# EAGLE design kachisys (EAGLE 9.1.3)
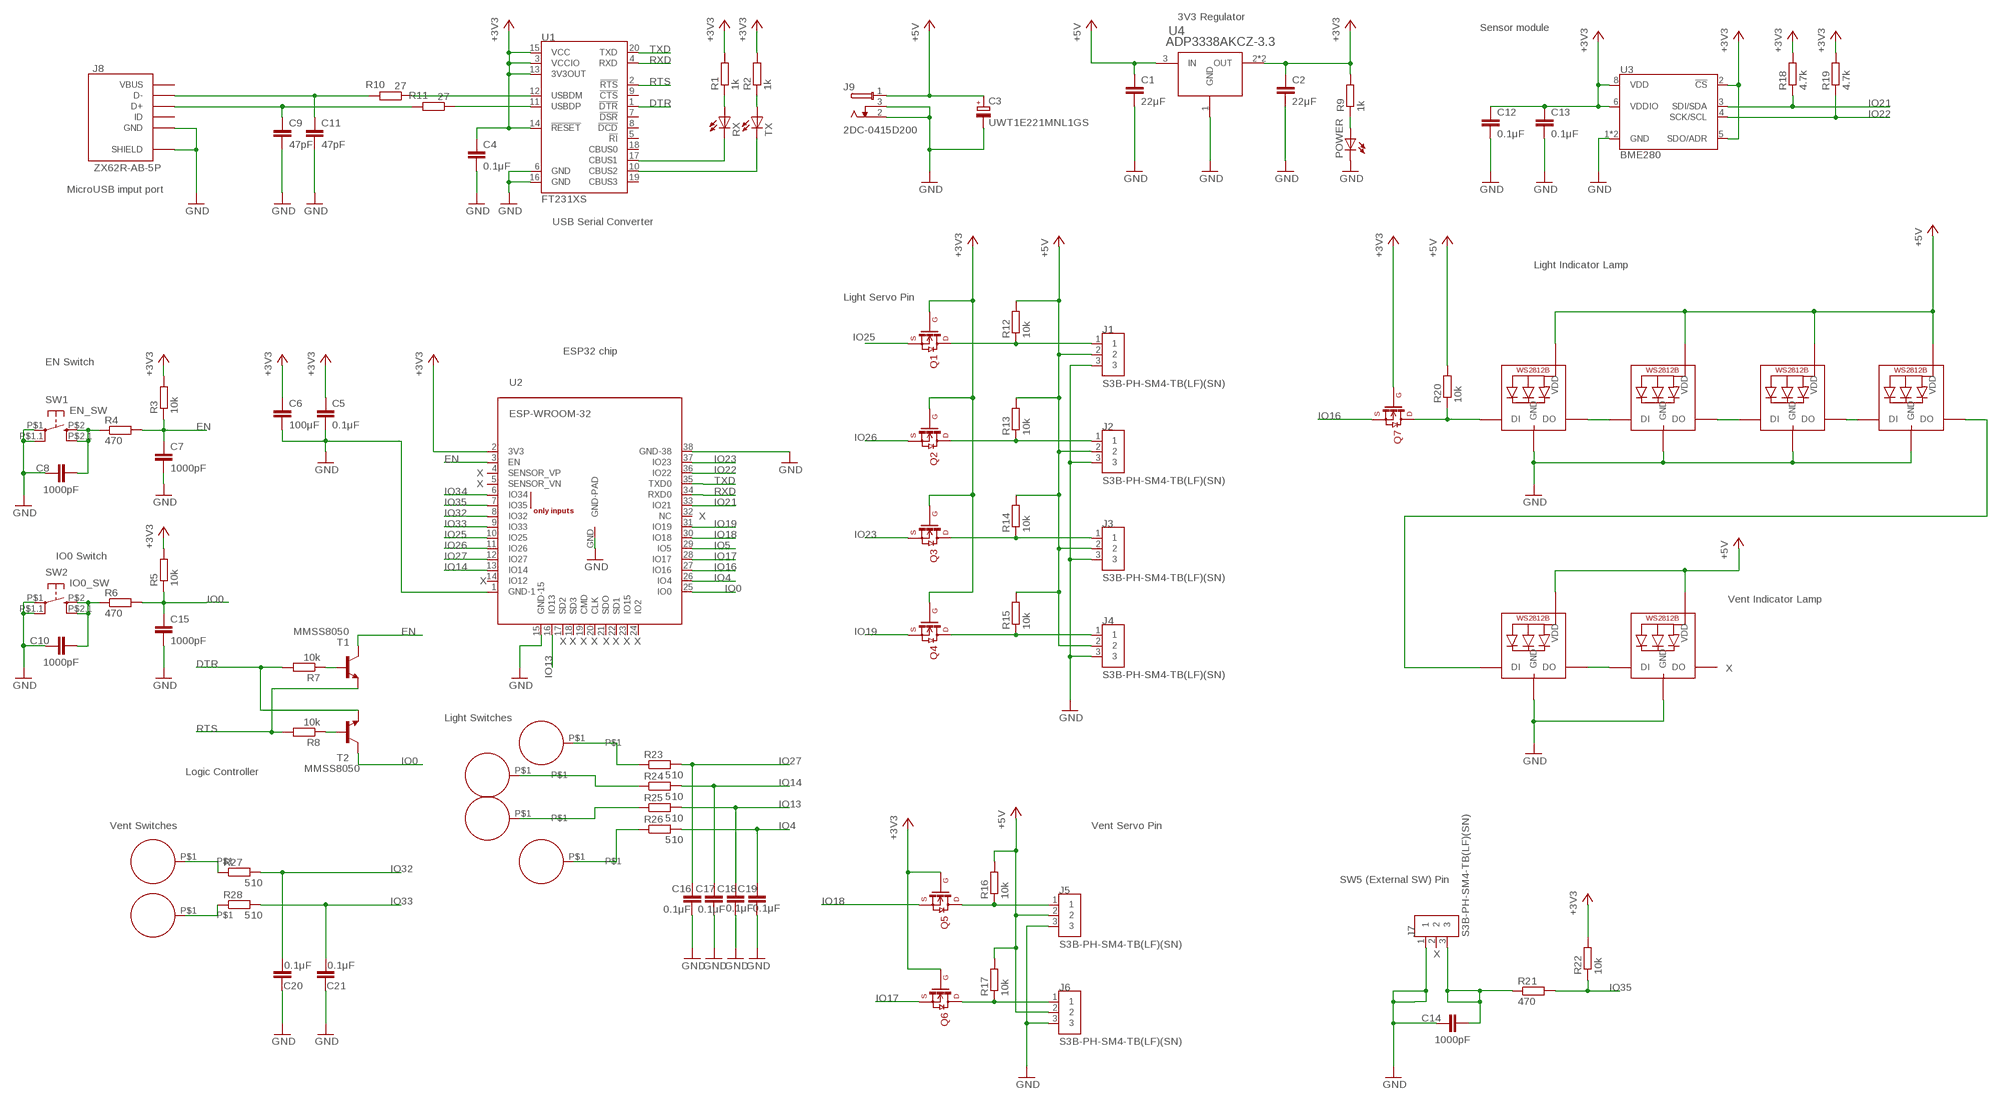
[diagram p0: schematic, sheet 1]

## Parts
C1  22μF  C-EUC2012  [C2012]
C2  22μF  C-EUC2012  [C2012]
C3  UWT1E221MNL1GS  [NICHICON-ALMINUM-CAPACITOR-8MM]
C4  0.1μF  C-EUC0603  [C0603]
C5  0.1μF  C-EUC0603  [C0603]
C6  100μF  C-EUC3225  [C3225]
C7  1000pF  C-EUC0603  [C0603]
C8  1000pF  C-EUC0603  [C0603]
C9  47pF  C-EUC1608  [C1608]
C10  1000pF  C-EUC0603  [C0603]
C11  47pF  C-EUC1608  [C1608]
C12  0.1μF  C-EUC0603  [C0603]
C13  0.1μF  C-EUC0603  [C0603]
C14  1000pF  C-EUC0603  [C0603]
C15  1000pF  C-EUC0603  [C0603]
C16  0.1μF  C-EUC0603  [C0603]
C17  0.1μF  C-EUC0603  [C0603]
C18  0.1μF  C-EUC0603  [C0603]
C19  0.1μF  C-EUC0603  [C0603]
C20  0.1μF  C-EUC0603  [C0603]
C21  0.1μF  C-EUC0603  [C0603]
J1  S3B-PH-SM4-TB(LF)(SN)  [JST_S3B-PH-SM4-TB(LF)(SN)]
J2  S3B-PH-SM4-TB(LF)(SN)  [JST_S3B-PH-SM4-TB(LF)(SN)]
J3  S3B-PH-SM4-TB(LF)(SN)  [JST_S3B-PH-SM4-TB(LF)(SN)]
J4  S3B-PH-SM4-TB(LF)(SN)  [JST_S3B-PH-SM4-TB(LF)(SN)]
J5  S3B-PH-SM4-TB(LF)(SN)  [JST_S3B-PH-SM4-TB(LF)(SN)]
J6  S3B-PH-SM4-TB(LF)(SN)  [JST_S3B-PH-SM4-TB(LF)(SN)]
J7  S3B-PH-SM4-TB(LF)(SN)  [JST_S3B-PH-SM4-TB(LF)(SN)]
J8  ZX62R-AB-5P  [ZX62R-B-5PA]
J9  2DC-0415D200  [2DC-0415D200]
LED1  WS2812B_5050N  [WS2812B-NARROW]
LED2  WS2812B_5050N  [WS2812B-NARROW]
LED3  WS2812B_5050N  [WS2812B-NARROW]
LED4  WS2812B_5050N  [WS2812B-NARROW]
LED5  WS2812B_5050N  [WS2812B-NARROW]
LED6  WS2812B_5050N  [WS2812B-NARROW]
POWER  LEDCHIP-LED0603  [CHIP-LED0603]
Q1  BSS138  [SOT-23]
Q2  BSS138  [SOT-23]
Q3  BSS138  [SOT-23]
Q4  BSS138  [SOT-23]
Q5  BSS138  [SOT-23]
Q6  BSS138  [SOT-23]
Q7  BSS138  [SOT-23]
R1  1k  R-EU_R0603  [R0603]
R2  1k  R-EU_R0603  [R0603]
R3  10k  R-EU_R0603  [R0603]
R4  470  R-EU_R0603  [R0603]
R5  10k  R-EU_R0603  [R0603]
R6  470  R-EU_R0603  [R0603]
R7  10k  R-EU_R0603  [R0603]
R8  10k  R-EU_R0603  [R0603]
R9  1k  R-EU_R0603  [R0603]
R10  27  R-EU_R0603  [R0603]
R11  27  R-EU_R0603  [R0603]
R12  10k  R-EU_R0603  [R0603]
R13  10k  R-EU_R0603  [R0603]
R14  10k  R-EU_R0603  [R0603]
R15  10k  R-EU_R0603  [R0603]
R16  10k  R-EU_R0603  [R0603]
R17  10k  R-EU_R0603  [R0603]
R18  4.7k  R-EU_R0603  [R0603]
R19  4.7k  R-EU_R0603  [R0603]
R20  10k  R-EU_R0603  [R0603]
R21  470  R-EU_R0603  [R0603]
R22  10k  R-EU_R0603  [R0603]
R23  510  R-EU_R0603  [R0603]
R24  510  R-EU_R0603  [R0603]
R25  510  R-EU_R0603  [R0603]
R26  510  R-EU_R0603  [R0603]
R27  510  R-EU_R0603  [R0603]
R28  510  R-EU_R0603  [R0603]
RX  LEDCHIP-LED0603  [CHIP-LED0603]
SW1  EN_SW  DTS6_SMD  [SKRPACE010]
SW2  IO0_SW  DTS6_SMD  [SKRPACE010]
T1  MMSS8050  -NPN-SOT23-EBC  [SOT23-EBC]
T2  MMSS8050  -NPN-SOT23-EBC  [SOT23-EBC]
TPAD1  ESP32-TOUCHPAD  [ESP32-TOUCHPAD-10MM]
TPAD2  ESP32-TOUCHPAD  [ESP32-TOUCHPAD-10MM]
TPAD3  ESP32-TOUCHPAD  [ESP32-TOUCHPAD-10MM]
TPAD4  ESP32-TOUCHPAD  [ESP32-TOUCHPAD-10MM]
TPAD5  ESP32-TOUCHPAD  [ESP32-TOUCHPAD-10MM]
TPAD6  ESP32-TOUCHPAD  [ESP32-TOUCHPAD-10MM]
TX  LEDCHIP-LED0603  [CHIP-LED0603]
U1  FT231XS  [SSOP20_L]
U2  ESP-WROOM-32  [ESP-WROOM-32]
U3  BME280  [LGA-8-2.5X2.5]
U4  ADP3338AKCZ-3.3  [SOT233]

## Nets
+3V3 [3V3]: C2.1 C4.1 C5.1 C6.1 C12.1 C13.1 Q1.G Q2.G Q3.G Q4.G Q5.G Q6.G Q7.G R1.2 R2.2 R3.2 R5.2 R9.2 R18.2 R19.2 R22.2 U1.3(VCCIO) U1.13(3V3OUT) U1.14(!RESET) U1.15(VCC) U2.2(3V3) U3.2(!CS) U3.5(SDO/ADR) U3.6(VDDIO) U3.8(VDD) U4.2(OUT) U4.4(OUT)
+5V [5V]: C1.1 C3.POS(+) J1.2 J2.2 J3.2 J4.2 J5.2 J6.2 J9.1 LED1.1-VDD(VDD) LED2.1-VDD(VDD) LED3.1-VDD(VDD) LED4.1-VDD(VDD) LED5.1-VDD(VDD) LED6.1-VDD(VDD) R12.2 R13.2 R14.2 R15.2 R16.2 R17.2 R20.2 U4.3(IN)
DTR: R7.2 T2.E U1.1(!DTR)
EN: C7.1 R3.1 R4.2 T1.C U2.3(EN)
GND [GND]: C1.2 C2.2 C3.NEG(-) C4.2 C5.2 C6.2 C7.2 C8.1 C9.2 C10.1 C11.2 C12.2 C13.2 C14.1 C15.2 C16.2 C17.2 C18.2 C19.2 C20.1 C21.1 J1.3 J2.3 J3.3 J4.3 J5.3 J6.3 J7.1 J8.GND J8.SHIELD@1(SHIELD) J8.SHIELD@2(SHIELD) J8.SHIELD@3(SHIELD) J8.SHIELD@4(SHIELD) J9.2 J9.3 LED1.3-GND(GND) LED2.3-GND(GND) LED3.3-GND(GND) LED4.3-GND(GND) LED5.3-GND(GND) LED6.3-GND(GND) POWER.C SW1.P$1(P) SW1.P$1.1(P1) SW2.P$1(P) SW2.P$1.1(P1) U1.6(GND) U1.16(GND) U2.1(GND-1) U2.15(GND-15) U2.38(GND-38) U2.GND(GND-PAD) U3.1(GND) U3.7(GND) U4.1(GND)
IO0: C15.1 R5.1 R6.2 T2.C U2.25(IO0)
IO4: C19.1 R26.2 U2.26(IO4)
IO5: U2.29(IO5)
IO13: C18.1 R25.2 U2.16(IO13)
IO14: C17.1 R24.2 U2.13(IO14)
IO16: Q7.S U2.27(IO16)
IO17: Q6.S U2.28(IO17)
IO18: Q5.S U2.30(IO18)
IO19: Q4.S U2.31(IO19)
IO21: R18.1 U2.33(IO21) U3.3(SDI/SDA)
IO22: R19.1 U2.36(IO22) U3.4(SCK/SCL)
IO23: Q3.S U2.37(IO23)
IO25: Q1.S U2.10(IO25)
IO26: Q2.S U2.11(IO26)
IO27: C16.1 R23.2 U2.12(IO27)
IO32: C20.2 R27.2 U2.8(IO32)
IO33: C21.2 R28.2 U2.9(IO33)
IO34: U2.6(IO34)
IO35: R21.2 R22.1 U2.7(IO35)
N$1: R27.1 TPAD5.P$1
N$2: C11.1 J8.D- R10.2
N$3: C9.1 J8.D+ R11.2
N$4: RX.C U1.17(CBUS1)
N$5: TX.C U1.10(CBUS2)
N$6: C8.2 R4.1 SW1.P$2(S) SW1.P$2.1(S1)
N$7: R1.1 RX.A
N$8: R2.1 TX.A
N$9: R7.1 T1.B
N$10: R8.1 T2.B
N$11: POWER.A R9.1
N$12: C10.2 R6.1 SW2.P$2(S) SW2.P$2.1(S1)
N$13: R28.1 TPAD6.P$1
N$14: R10.1 U1.12(USBDM)
N$15: R11.1 U1.11(USBDP)
N$16: J1.1 Q1.D R12.1
N$17: J2.1 Q2.D R13.1
N$18: J3.1 Q3.D R14.1
N$19: J4.1 Q4.D R15.1
N$21: LED1.2-DOUT(DO) LED2.4-DIN(DI)
N$33: LED2.2-DOUT(DO) LED3.4-DIN(DI)
N$38: LED3.2-DOUT(DO) LED4.4-DIN(DI)
N$39: LED4.2-DOUT(DO) LED5.4-DIN(DI)
N$40: J5.1 Q5.D R16.1
N$41: J6.1 Q6.D R17.1
N$42: LED5.2-DOUT(DO) LED6.4-DIN(DI)
N$43: LED1.4-DIN(DI) Q7.D R20.1
N$46: C14.2 J7.3 R21.1
N$50: R23.1 TPAD1.P$1
N$51: R24.1 TPAD2.P$1
N$52: R25.1 TPAD3.P$1
N$53: R26.1 TPAD4.P$1
RTS: R8.2 T1.E U1.2(!RTS)
RXD: U1.4(RXD) U2.34(RXD0)
TXD: U1.20(TXD) U2.35(TXD0)
Unconnected: J7.2 J8.ID J8.VCC(VBUS) LED6.2-DOUT(DO) U1.5(!RI) U1.7(!DSR) U1.8(!DCD) U1.9(!CTS) U1.18(CBUS0) U1.19(CBUS3) U2.4(SENSOR_VP) U2.5(SENSOR_VN) U2.14(IO12) U2.17(SD2) U2.18(SD3) U2.19(CMD) U2.20(CLK) U2.21(SDO) U2.22(SD1) U2.23(IO15) U2.24(IO2) U2.32(NC)

## Notes on the sheet
- 3V3 Regulator
- Sensor module
- MicroUSB imput port
- USB Serial Converter
- Light Indicator Lamp
- Light Servo Pin
- ESP32 chip
- EN Switch
- X
- X
- X
- IO0 Switch
- X
- Vent Indicator Lamp
- X | X | X | X | X | X | X | X
- X
- Light Switches
- Logic Controller
- Vent Switches | Vent Servo Pin
- SW5 (External SW) Pin
- X

## Library data of the parts
C1 C2 C4-C8 C10 C12-C21 = resistor:C-EU: CAPACITOR, European symbol
C3 = taki-library:UWT1E221MNL1GS
C9 C11 = 150927 Library by matsu:C-EU: CAPACITOR, European symbol
J1-J7 = S3B-PH-SM4-TB_LF__SN_:S3B-PH-SM4-TB(LF)(SN): CONN HEADER PH SIDE 3POS 2MM SMD; DESCRIPTION: PH Series 3 Position 2.0 mm SMT Side Entry Shrouded Header; DIGI-KEY_PART_NUMBER: 455-1750-1-ND; DIGI-KEY_PURCHASE_URL: https://www.digikey.jp/product-detail/en/jst-sales-america-inc/S3B-PH-SM4-TB_LF__SN_/455-1750-1-ND/926847?utm_source=snapeda&utm_medium=aggregator&utm_campaign=symbol; MF: JST Sales; MP: S3B-PH-SM4-TB_LF__SN_; PACKAGE: None
J8 = taki-library:ZX62
J9 = taki-library:2DC-0415D200
LED1-LED6 = adafruit:WS2812B
POWER RX TX = led:LED: LED OSRAM: - CHIPLED LG R971, LG N971, LY N971, LG Q971, LY Q971, LO R971, LY R971 LH N974, LH R974 LS Q976, LO Q976, LY Q976 LO Q996 - Hyper CHIPLED LW Q18S LB Q993, LB Q99A, LB R99A - SideLED LS A670, LO A670, LY A670, LG A670, LP A670 LB A673, LV A673, LT A673, LW A673 LH A674 LY A675 LS A676, LA A676, LO A676, LY A676, LW A676 LS A679, LY A679, LG A679 - Hyper Micro SIDELED® LS Y876, LA Y876, LO Y876, LY Y876 LT Y87S - SmartLED LW L88C, LW L88S LB L89C, LB L89S, LG L890 LS L89K, LO L89K, LY L89K LS L896, LA L896, LO L896, LY L896 - TOPLED LS T670, LO T670, LY T670, LG T670, LP T670 LSG T670, LSP T670, LSY T670, LOP T670, LYG T670 LG T671, LOG T671, LSG T671 LB T673, LV T673, LT T673, LW T673 LH T674 LS T676, LA T676, LO T676, LY T676, LB T676, LH T676, LSB T676, LW T676 LB T67C, LV T67C, LT T67C, LS T67K, LO T67K, LY T67K, LW E67C LS E67B, LA E67B, LO E67B, LY E67B, LB E67C, LV E67C, LT E67C LW T67C LS T679, LY T679, LG T679 LS T770, LO T770, LY T770, LG T770, LP T770 LB T773, LV T773, LT T773, LW T773 LH T774 LS E675, LA E675, LY E675, LS T675 LS T776, LA T776, LO T776, LY T776, LB T776 LHGB T686 LT T68C, LB T68C - Hyper Mini TOPLED® LB M676 - Mini TOPLED Santana® LG M470 LS M47K, LO M47K, LY M47K Source: http://www.osram.convergy.de LUXEON: - LUMILED® LXK2-PW12-R00, LXK2-PW12-S00, LXK2-PW14-U00, LXK2-PW14-V00 LXK2-PM12-R00, LXK2-PM12-S00, LXK2-PM14-U00 LXK2-PE12-Q00, LXK2-PE12-R00, LXK2-PE12-S00, LXK2-PE14-T00, LXK2-PE14-U00 LXK2-PB12-K00, LXK2-PB12-L00, LXK2-PB12-M00, LXK2-PB14-N00, LXK2-PB14-P00, LXK2-PB14-Q00 LXK2-PR12-L00, LXK2-PR12-M00, LXK2-PR14-Q00, LXK2-PR14-R00 LXK2-PD12-Q00, LXK2-PD12-R00, LXK2-PD12-S00 LXK2-PH12-R00, LXK2-PH12-S00 LXK2-PL12-P00, LXK2-PL12-Q00, LXK2-PL12-R00 Source: www.luxeon.com KINGBRIGHT: KA-3528ASYC Source: www.kingbright.com
Q1-Q7 = 180118 Library by matsu:BSS138
R1-R28 = resistor:R-EU_: RESISTOR, European symbol
SW1 SW2 = 180118 Library by matsu:DTS6_SMD
T1 T2 = transistor-neu-to92:*-NPN-: NPN Transistror
TPAD1-TPAD6 = 180118 Library by matsu:ESP32-TOUCHPAD
U1 = SparkFun-IC-Comms:FT231X: FTDI FT231X Full Speed USB to Full-handshake UART This USB2.0 Full Speed IC offers a compact bridge to full handshake UART interfaces. The device is a UART, capable of operating up to 3MBaud, with low power consumption (8mA). The FT231X includes the complete FT-X series feature set and enables USB to be added into a system design quickly and easily over a UART interface. Datasheet <http://cdn.sparkfun.com/datasheets/Components/General%20IC/DS_FT231X.pdf> SparkFun Products SparkFun RedBoard - Programmed with Arduino <https://www.sparkfun.com/products/12757> (DEV-12757) SparkFun XBee Explorer USB <https://www.sparkfun.com/products/11812> (WRL-11812) SparkFun XBee Explorer Dongle <https://www.sparkfun.com/products/11697> (WRL-11697) SparkFun Blynk Board - ESP8266 <https://www.sparkfun.com/products/13794> (WRL-13794) SparkFun ESP8266 Thing - Dev Board <https://www.sparkfun.com/products/13711> (WRL-13711) SparkFun Block for Intel® Edison - Base <https://www.sparkfun.com/products/13045> (DEV-13045) SparkFun RedStick <https://www.sparkfun.com/products/13741> (DEV-13741) SparkFun Beefy 3 - FTDI Basic Breakout <https://www.sparkfun.com/products/13746> (DEV-13746) SparkFun FT231X Breakout <https://www.sparkfun.com/products/11736> (BOB-11736); PROD_ID: IC-11524
U2 = taki-library:ESP-WROOM-32
U3 = taki-library:BME280: Bosch BME280 – Combined Humidity and Pressure Sensor The BME280 is as combined digital humidity, pressure and temperature sensor based on proven sensing principles. The sensor module is housed in an extremely compact metal-lid LGA package with a footprint of only 2.5×2.5mm² with a height of 0.93mm. Its small dimensions and its low power consumption allow the implementation in battery driven devices such as handsets, GPS modules or watches. Datasheet <https://cdn.sparkfun.com/assets/learn_tutorials/4/1/9/BST-BME280_DS001-10.pdf> SparkFun Products SparkFun Atmospheric Sensor Breakout - BME280 <https://www.sparkfun.com/products/13676> (SEN-13676); PROD_ID: IC-13090
U4 = taki-library:ADP3338AKCZ-3.3

## Board
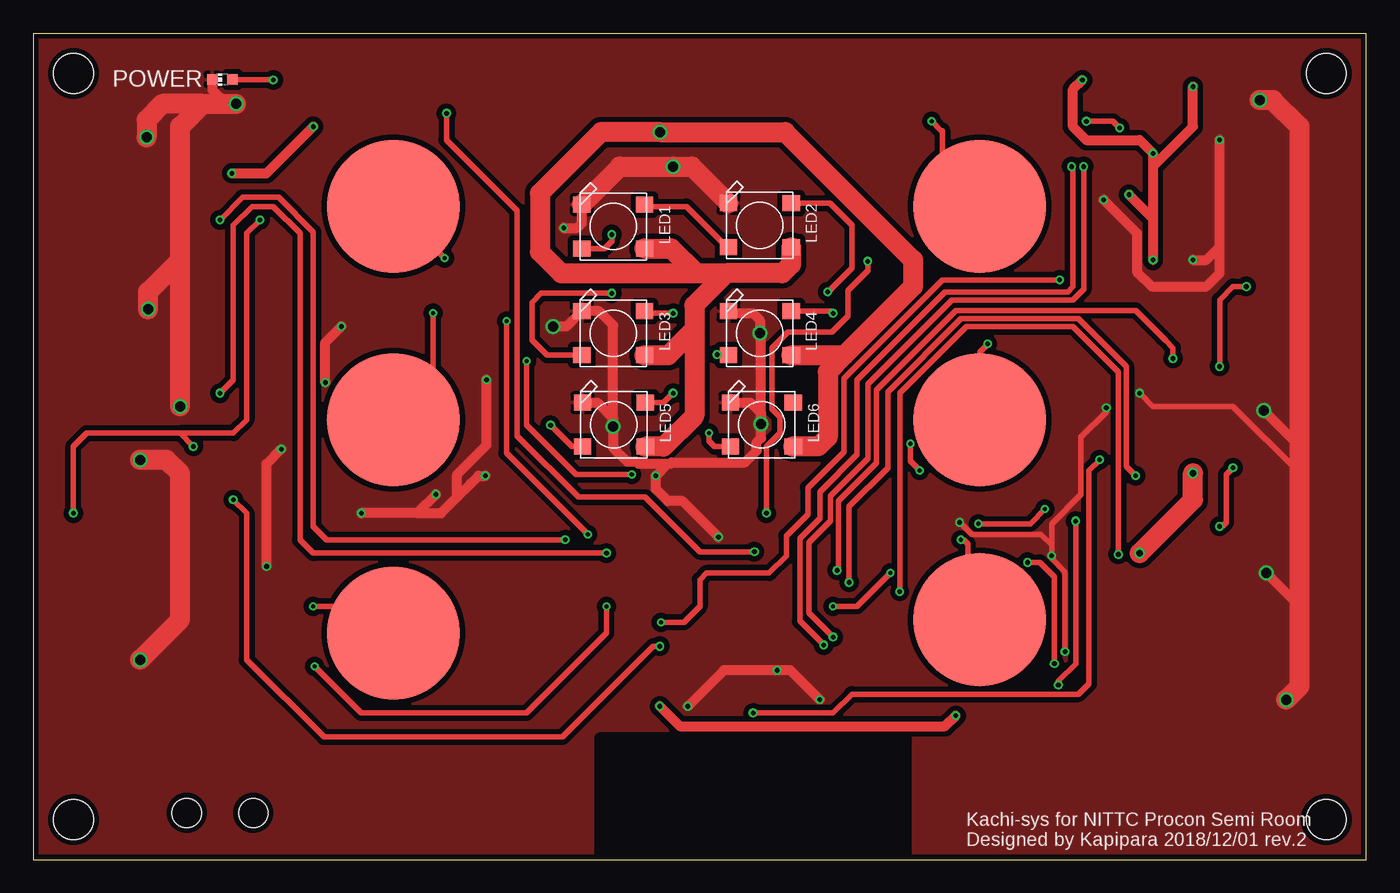
[diagram p1: board, top side]
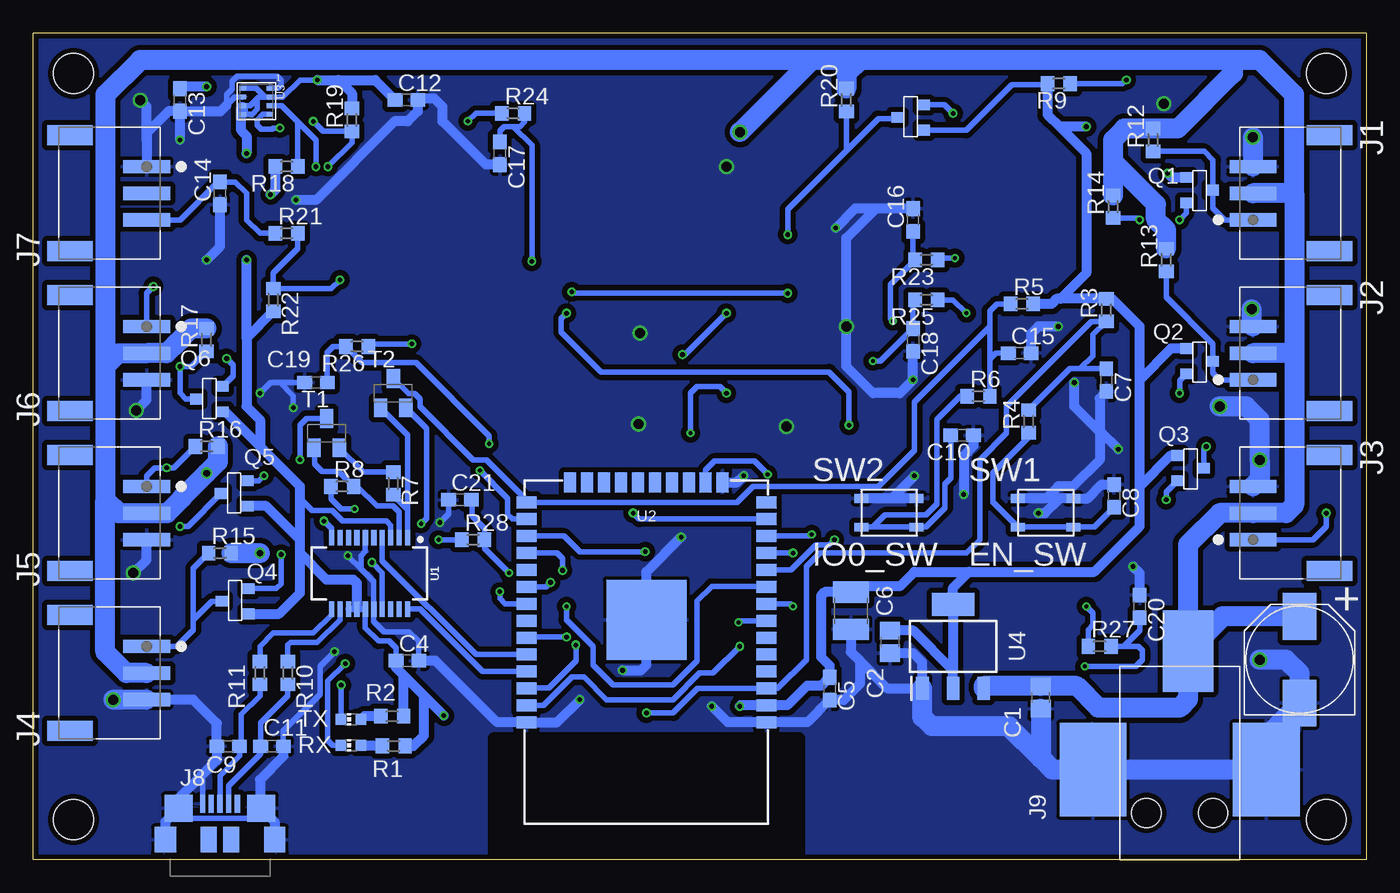
[diagram p2: board, bottom side, seen from below]

Size 100 x 62 mm. Coordinates in mm from the lower left corner, seen from the top.
Outline: 0,0 100,0 100,62 0,62 0,0
Copper layers (1*16): Top 0.035mm / dielectric 1.5mm / Bottom 0.035mm
Design rules "Elecrow_2-layer_eagle_rule": minimum track width 6mil, minimum drill 12mil, track to track 6mil, track to pad 6mil, pad to pad 6mil, via to via 6mil, smd to smd 0mil, copper to edge 10mil, drill to drill 10mil, minimum pad ring 10mil, minimum via ring 6mil, stop-mask expansion 2mil, vias tented up to drill 100mil, thermal gap 10mil
Holes 3 mm at 3,59 97,59 3,3 97,3

### Footprints (pad centres in the part's own frame; a part is rotated, then mirrored left to right if it is on the bottom)
C2012 = smd 1.3 x 1.5: 1 -0.85,0; 2 0.85,0
NICHICON-ALMINUM-CAPACITOR-8MM = smd 2.5 x 3.5: NEG 0,-3.25; POS 0,3.25
C0603 = smd 1.1 x 1: 1 -0.85,0; 2 0.85,0
C3225 = smd 1.6 x 2.7: 1 -1.4,0; 2 1.4,0
C1608 = smd 1.1 x 1: 1 -0.85,0; 2 0.85,0
JST_S3B-PH-SM4-TB(LF)(SN) = smd 1 x 3.5: 1 2,0; 2 0,0; 3 -2,0 | smd 1.5 x 3.4: P1 -4.35,5.75; P2 4.35,5.75
ZX62R-B-5PA = smd 0.4 x 1.35: D+ 0,2.675; D- 0.65,2.675; GND -1.3,2.675; ID -0.65,2.675; VCC 1.3,2.675 | smd 1.2 x 1.9: NC@1 -0.85,0; NC@2 0.85,0 | smd 2.1 x 2: SHIELD@1 -3.1,2.35; SHIELD@2 3.1,2.35 | smd 1.6 x 1.9: SHIELD@3 -4.1,0; SHIELD@4 4.1,0
2DC-0415D200 = smd 6.1 x 3.8: 1 15.65,-0.63 | smd 7 x 5: 2 6.75,6.5; 3 6.75,-6.5 | hole 2.2: 3.5,2.5; 3.5,-2.5
WS2812B-NARROW = smd 1.3 x 1.2: 1-VDD 2.35,-1.65; 2-DOUT 2.35,1.65; 3-GND -2.35,1.65; 4-DIN -2.35,-1.65
CHIP-LED0603 = smd 0.8 x 0.8: A 0,-0.75; C 0,0.75
SOT-23 = smd 0.8 x 0.9: D 0.95,2; G 0,0; S 1.9,0
R0603 = smd 1 x 1.1: 1 -0.85,0; 2 0.85,0
SKRPACE010 = smd 1.05 x 0.65: P$1 0,2.15; P$1.1 4.15,2.15; P$2 0,0; P$2.1 4.15,0
SOT23-EBC = smd 1 x 1.4: B 0.95,-1.1; C 0,1.1; E -0.95,-1.1
ESP32-TOUCHPAD-10MM = smd 10 x 10: P$1 0,0
SSOP20_L = smd 0.381 x 1.143: 1 -2.857,-2.68; 2 -2.223,-2.68; 3 -1.587,-2.68; 4 -0.953,-2.68; 5 -0.318,-2.68; 6 0.318,-2.68; 7 0.953,-2.68; 8 1.587,-2.68; 9 2.223,-2.68; 10 2.857,-2.68; 11 2.857,2.68; 12 2.223,2.68; 13 1.587,2.68; 14 0.953,2.68; 15 0.318,2.68; 16 -0.318,2.68; 17 -0.953,2.68; 18 -1.587,2.68; 19 -2.223,2.68; 20 -2.857,2.68
ESP-WROOM-32 = smd 0.9 x 1.5: 1 7.7,9; 2 6.43,9; 3 5.16,9; 4 3.89,9; 5 2.62,9; 6 1.35,9; 7 0.08,9; 8 -1.19,9; 9 -2.46,9; 10 -3.73,9; 11 -5,9; 12 -6.27,9; 13 -7.54,9; 14 -8.81,9; 25 -8.81,-9; 26 -7.54,-9; 27 -6.27,-9; 28 -5,-9; 29 -3.73,-9; 30 -2.46,-9; 31 -1.19,-9; 32 0.08,-9; 33 1.35,-9; 34 2.62,-9; 35 3.89,-9; 36 5.16,-9; 37 6.43,-9; 38 7.7,-9 | smd 1.5 x 0.9: 15 -10.3,5.715; 16 -10.3,4.445; 17 -10.3,3.175; 18 -10.3,1.905; 19 -10.3,0.635; 20 -10.3,-0.635; 21 -10.3,-1.905; 22 -10.3,-3.175; 23 -10.3,-4.445; 24 -10.3,-5.715 | smd 6 x 6: GND 0,0
LGA-8-2.5X2.5 = smd 0.35 x 0.5: 1 -0.975,1.025; 2 -0.325,1.025; 3 0.325,1.025; 4 0.975,1.025; 5 0.975,-1.025; 6 0.325,-1.025; 7 -0.325,-1.025; 8 -0.975,-1.025
SOT233 = smd 1.75 x 0.95: 1 -3.15,2.3; 2 -3.15,0; 3 -3.15,-2.3 | smd 1.75 x 3.2: 4 3.15,0

### Placement (x,y rotation side)
C1  24.42,12.16 270 bottom
C2  35.73,16.33 270 bottom
C3  5,15 0 bottom
C4  71.93,14.92 0 bottom
C5  40.26,12.82 270 bottom
C6  38.66,18.66 270 bottom
C7  19.5,35.98 270 bottom
C8  18.92,27.28 270 bottom
C9  85.38,8.5 180 bottom
C10  30.31,31.84 180 bottom
C11  82.1,8.5 0 bottom
C12  72,57 0 bottom
C13  89,57 270 bottom
C14  86,50 90 bottom
C15  26,38 0 bottom
C16  34,48 90 bottom
C17  65,53 270 bottom
C18  34,39 270 bottom
C19  78.8,35.8 180 bottom
C20  17,19 270 bottom
C21  68,27 0 bottom
J1  8.5,50 270 bottom
J2  8.5,38 270 bottom
J3  8.5,26 270 bottom
J4  91.5,14 90 bottom
J5  91.5,26 90 bottom
J6  91.5,38 90 bottom
J7  91.5,50 90 bottom
J8  86,1.5 0 bottom
J9  14,0 90 bottom
LED1  43.5,47.5 0 top
LED2  54.5,47.6 0 top
LED3  43.5,39.5 0 top
LED4  54.5,39.5 0 top
LED5  43.55,32.63 0 top
LED6  54.66,32.63 0 top
POWER  14.18,58.53 90 top
Q1  13.5,51.18 270 bottom
Q2  13.5,38.35 270 bottom
Q3  14.16,30.32 270 bottom
Q4  83.86,18.44 90 bottom
Q5  83.93,26.52 90 bottom
Q6  85.78,33.61 90 bottom
Q7  33.17,54.73 90 bottom
R1  72.95,8.53 0 bottom
R2  73.06,10.76 0 bottom
R3  19.5,41.24 90 bottom
R4  25.33,32.89 90 bottom
R5  25.83,41.69 0 bottom
R6  29.09,34.77 0 bottom
R7  73,28.22 270 bottom
R8  76.82,28 0 bottom
R9  23.06,58.22 180 bottom
R10  80.9,14 270 bottom
R11  83,14 270 bottom
R12  16,54 90 bottom
R13  15,45 90 bottom
R14  19,49 90 bottom
R15  86,23 0 bottom
R16  87,31 0 bottom
R17  87,39 90 bottom
R18  81,52 180 bottom
R19  76.1,55.5 90 bottom
R20  39,57 90 bottom
R21  81,47 0 bottom
R22  82,42 270 bottom
R23  33,45 180 bottom
R24  64,56 0 bottom
R25  33,42 180 bottom
R26  75.7,38.5 180 bottom
R27  20,16 0 bottom
R28  67,24 0 bottom
RX  76.17,8.57 90 bottom
SW1  26.13,24.95 0 bottom
SW2  37.88,24.95 0 bottom
T1  78,32 0 bottom
T2  73,35 0 bottom
TPAD1  27,49 0 top
TPAD2  71,49 0 top
TPAD3  27,33 0 top
TPAD4  71,33 0 top
TPAD5  27,17 0 top
TPAD6  71,18 0 top
TX  76.17,10.52 90 bottom
U1  74.77,21.47 180 bottom
U2  54,18 270 bottom
U3  83.27,56.89 270 bottom
U4  31,16 90 bottom

### Tracks (layer width: path | path; a pad name or v marks a point on that pad's centre or on a via)
+3V3  (via drill 0.35)
  Top 0.75: 84,52 v84,53 83,54 79,54 78,55 78,57.8 v78.7,58.5 | 84,52 84,48.1 | 84,48.1 v84,45 | v82.2,49.9 84,48.1 | v69.2,10.8 68.4,10 48.5,10 v47,11.5 | v14.9,51.5 17.5,51.5 v21,55 | 84,52 87,55 v87,58
  Bottom 0.4: C4.1 72.8,14.94 72.8,15.9 73.3,16.4 74.1,16.4 75.09,17.39 U1.15 | Q7.G 30,54.73 26.6,58.13 24,58.13 | U1.3 73.18,25.08 73.5,25.4 76.8,25.4 77.6,26.2 79.1,26.2 80,27.1 | U3.2 82.27,57.2 83.1,57.2 83.15,57.15 | 83.15,57.15 83.65,56.65 83.73,56.57 U3.6 | U3.2 82.62,57.22 83.27,57.87 U3.8 | 83.15,57.15 83.2,57.1 83.2,56.3 83.6,55.9 83.7,55.9 83.72,55.92 U3.5 | U3.2 81.28,57.22 80,58.5 v78.7,58.5
  Bottom 0.5: U1.15 U1.14 U1.13
  Bottom 0.75: 17,28 17,25 20.4,21.6 29.8,21.6 | 17,28 17,36 | 17,36 17,40 19.09,42.09 R3.2 22.91,42.09 | 22.91,42.09 23.21,42.09 23.6,41.7 R5.2 | Q3.G 14.68,30.32 17,28 | Q2.G 14.65,38.35 17,36 | 29.8,21.6 33.9,21.6 35,20.5 38.22,20.5 C6.1 40.64,20.06 40.9,19.8 40.9,15.2 40.26,14.55 C5.1 40.88,13.04 41.96,13.04 43.43,11.57 U2.2 46.93,11.57 v47,11.5 | Q4.G 81.56,18.43 80,20 80,23 | 80,24 80,27.1 80,28 83,31 | 83,31 85.61,33.61 Q6.G | R22.2 84,39.15 | 84,39.15 84,34 83,33 83,31 | U1.14 75.72,20.72 76,21 78,21 80,23 | 80,23 80,24 | 80,24 82.52,26.52 Q5.G | v69.2,10.8 70.7,12.3 | 70.7,12.3 72.21,13.81 | 72.8,14.94 72.8,14.4 72.21,13.81 | R2.2 72.21,13.81 | R1.2 71.47,8.53 70.7,9.3 70.7,12.3 | 24,58.13 R9.2 23.91,55.91 23,55 | 84,39.15 v84,45 | R18.2 81.85,50.25 v82.2,49.9 | v78.7,58.5 77.1,58.5 | 77.1,58.5 76.1,57.5 R19.2 | 77.1,58.5 74.35,58.5 C12.1 | 23,55 21,53 21,44 22.91,42.09 | Q1.G 14.58,51.18 v14.9,51.5 | v21,55 23,55 | U4.2 31,14.2 | C2.1 33.98,17.18 31,14.2 | 31,14.2 U4.4 31,20.4 29.8,21.6 | U3.5 84.3,56.49 84.38,56.49 84.4,56.47 84.4,54.7 84,54.3 v84,53 | v87,58 88.85,58 C13.1
+5V  (via drill 0.5, 0.75)
  Top 1.5: v83,23 87,27 v87,29 | 49.7,44 52,44 | 49.7,44 39.6,44 38,45.6 38,50 42.6,54.6 v47,54.6 56.4,54.6 66,45 66,43 60.85,37.85 | LED1.1-VDD 47.85,45.85 49.7,44 | LED6.1-VDD 57.03,31 58.9,31 59.6,31.7 59.6,36.6 60.85,37.85 | LED4.1-VDD 60.85,37.85 | 52,44 49.6,41.6 49.6,39.8 | 49.6,39.8 49.6,33.3 47.28,30.98 LED5.1-VDD | LED3.1-VDD 47.65,37.85 49.6,39.8 | LED2.1-VDD 56.85,44.65 56.2,44 52,44
  Bottom 1.5: 5.4,50 5.4,38 | 5.4,50 5.4,57.4 8,60 10,60 | R15.2 v83,23 | R16.2 86.15,29.85 v87,29 88.85,27.15 88.85,27.13 89.97,26 J5.2 93.6,26 94.6,27 | 10,60 38,60 | 38,60 41.6,60 | 41.6,60 92,60 94.6,57.4 94.6,37 | 94.6,37 94.6,27 | 10,60 10,59 14.15,54.85 R12.2 18.15,54.85 19,54 19,52.4 | 19,52.4 R14.2 | C3.POS 10.77,18.25 J9.1 | 41.6,60 v47,54.6 | 38,60 39,59 R20.2 | R13.2 15,47.26 15.77,48.03 15.77,49.17 19,52.4 | J9.1 13.37,23.63 11,26 J3.2 6,26 5.4,26.6 5.4,38 | 5.4,50 J1.2 | 5.4,38 J2.2 | 94.6,37 93.6,38 J6.2 90,38 89.4,38.6 89.38,38.6 88.85,39.13 88.85,39.15 88.15,39.85 R17.2 | J4.2 93.03,14 94.6,15.57 94.6,27 | J9.1 13.37,12.03 14,11.4 20.1,11.4 21.71,13.01 C1.1 28.7,13.01 U4.3
DTR
  Bottom 0.4: U1.1 71.91,26 | 71.91,26 71.91,26.29 R7.2 | 71.91,26 71.91,31.86 T2.E
EN  (via drill 0.35)
  Top 0.4: v54,11 60,11 61.4,12.4 78.4,12.4 78.5,12.5 79,13 | v80,30 79.2,29.2 79.2,13.2 | 79.2,13.2 79,13 | 79.2,13.2 79,13
  Bottom 0.4: v54,11 52,11 50.16,12.84 U2.3 44.16,12.84 42,15 42,22 41,23 30,23 29,24 29,30 27,32 27,34 20.61,40.39 R3.1 20.5,39.39 20.5,37.8 21.47,36.83 21.8,36.83 | R4.2 22.23,36.83 21.8,36.83 | 21.8,36.83 C7.1 | T1.C 79.5,33.1 80,32.6 v80,30
GND  (via drill 0.35, 0.75)
  Top 0.4: 76.4,23.6 v76.4,22.8 76.4,22.6 77.4,21.6 v77.4,15.6 | v69.5,25.3 70.4,24.4 75.6,24.4 76.4,23.6 | 76.4,23.6 76.4,25.2 78.6,27.4 78.6,31.7 80.5,33.6 v80.5,33.9 | v83,35 84,34 90,34 95,29
  Top 0.75: v39,40 40,40 LED3.3-GND 42.45,41.15 43.5,40.1 v43.5,32.5 | LED4.3-GND 52.3,41 54,41 54.5,40.5 v54.5,39.5 54.6,39.4 v54.6,32.7 | LED6.3-GND 53.82,34.28 54.6,33.5 v54.6,32.7 | POWER.C 13.43,57.77 14.5,56.7 v15.2,56.7 | v87,45 88,45 89,46 | v59,12 56.8,14.2 v55.8,14.2 51.8,14.2 v49.1,11.5 | v51.4,24.2 48.7,26.9 47.6,26.9 46.7,27.8 v46.7,28.8 47.6,29.7 | 47.6,29.7 47.81,29.7 47.91,29.8 53.4,29.8 54.27,30.67 54.27,31.3 54.6,31.63 v54.6,32.7 | v43.5,32.5 43.5,30.9 44.55,29.85 45.22,29.85 45.37,29.7 47.6,29.7 | v17.5,22 17.5,29.7 v18.6,30.8 | v21.9,35.8 21.9,38.8 v23.1,40 | v30.2,27.4 28.8,26 | 28.8,26 v24.6,26 | 28.8,26 30.6,26 31.8,27.2 | 31.8,27.2 32.8,28.2 33.4,28.8 v33.9,28.8 | 31.8,27.2 31.8,28.9 34,31.1 v34,36 | LED5.3-GND 42.32,34.28 43.5,33.1 v43.5,32.5 | 89,46 v89,54 | 95,31 v92.3,33.7 | 95,19 v92.5,21.5 | v39.8,47.4 40.8,47.4 41.15,47.75 LED1.3-GND | v80.3,49.5 82.8,47 82.8,44.1 83.9,43 88,43 89,44 89,46
  Top 1.5: LED1.3-GND 44,52 v48,52 49.4,52 LED2.3-GND | v8,15 11,18 11,29 10,30 v8,30 | v11,34 11,45 | 11,45 11,55 12.7,56.7 | 12.7,56.7 v15.2,56.7 | 12.7,56.7 9.7,56.7 8.5,55.5 v8.5,54.2 | v8.6,41.3 8.6,42.6 11,45 | v94,12 95,13 95,19 95,20 95,29 95,31 95,55 93,57 v92,57
  Bottom 0.4: C4.2 71.1,14.94 71.1,16.4 71.8,17.1 73.7,17.1 74.45,17.85 U1.16 74.45,20.85 75.4,21.8 | 75.4,21.8 75.4,22.8 75.09,23.11 U1.6 | 75.4,21.8 v76.4,22.8 | C21.1 68.85,25.95 v69.5,25.3 | U3.1 81.63,57.87 81.4,58.1 81.4,58.5 81.7,58.8 84.7,58.8 85.1,58.4 85.1,57.8 85.5,57.4 85.5,57 85.5,56.6 84.88,57.22 U3.7 | J8.SHIELD@2 83.65,3.1 88.35,3.1 J8.SHIELD@1 | v77.4,15.6 78.5,14.5 78.5,12.4 81.25,9.65 C11.2 | v83,35 82.2,35.8 82,35.8 81.6,35.8 81.5,35.8 | v80.5,33.9 80.5,34.8 81.5,35.8 | J8.GND 87.3,6.32 87.38,6.32 | 81.5,35.8 C19.2
  Bottom 0.75: C6.2 38.66,15.56 38,14.9 | 38,14.9 38,13.17 39.2,11.97 C5.2 41.92,10.3 U2.1 47.9,10.3 v49.1,11.5 | v87,45 86,46 C14.1 | 23.1,27.1 SW1.P$1.1 20.9,27.1 19.87,28.13 C8.1 | 23.1,27.1 24,27.1 | 24,27.1 SW1.P$1 | SW2.P$1.1 35.7,27.1 | 35.7,27.1 SW2.P$1 | 38,14.9 35.95,12.85 U4.1 33.3,14.8 33.98,15.48 C2.2 | C7.2 20,34.63 20,32.1 | 20,32.1 20,30 22,28 23.1,28 24,27.1 | J8.SHIELD@3 90.1,2.85 J8.SHIELD@1 89.1,4.6 87.38,6.32 86.23,7.47 C9.2 86.23,10.23 88,12 J4.3 | J8.SHIELD@2 81.9,2.85 J8.SHIELD@4 | C4.2 69.82,14.92 65.2,10.3 U2.38 60.7,10.3 v59,12 | v51.4,24.2 54,21.6 U2.GND 54,14.6 54.4,14.2 v55.8,14.2 | U2.15 47.2,28.3 v46.7,28.8 | C20.1 17,21.5 v17.5,22 | v18.6,30.8 19.9,32.1 20,32.1 | 20,32.1 21.9,34 v21.9,35.8 | v23.1,40 24.6,40 25.15,39.45 C15.2 | C10.1 29.46,31.04 30.2,30.3 v30.2,27.4 | v24.6,26 24.1,26 23.1,27 23.1,27.1 | v33.9,28.8 35.6,27.1 35.7,27.1 | C18.2 v34,36 35,35 37,35 39,37 v39,40 39,46.65 36.8,48.85 | v89,54 C13.2 | C13.2 89.85,56.15 91.5,54.5 91.5,54 | 91.5,54 J7.1 | C13.2 85.95,56.15 85.5,56.6 | C17.2 66.05,52.15 69.3,55.4 69.3,56.5 69.9,57.1 71.05,57.1 C12.2 71.15,56.15 71.9,55.4 72.9,55.4 78.8,49.5 v80.3,49.5 | 91.5,54 91.5,56.5 v92,57 | v92.3,33.7 91.5,34.5 J6.3 | v92.5,21.5 91.5,22.5 J5.3 | C16.2 36.8,48.85 | 36.8,48.85 38.35,48.85 v39.8,47.4 | C11.2 81.25,7.75 83,6 83,3.95 82.92,3.88 82.9,3.88
  Bottom 1.5: 24.42,7.62 23.55,6.75 J9.2 J9.3 7.5,9.25 C3.NEG 5,14 6,15 v8,15 | 24.42,7.62 26.8,10 32.6,10 33.3,10.7 U4.1 | J3.3 8,28.5 v8,30 8,33 9,34 v11,34 | v8.5,54.2 J1.3 | J2.3 8.6,40.1 v8.6,41.3 | J4.3 v94,12 | C1.2 24.42,7.62
  pour Top (isolate 0.4): 0,62 100,62 100,0 0,0
  pour Bottom (isolate 0.4): 0,62 100,62 100,0 0,0
IO0
  Bottom 0.4: T2.C 71.85,34.95 71.4,34.95 71,34.55 71,34 67,30 66,30 63,27 U2.25 47.19,26.81 46,28 36.6,28 33.9,30.7 33.9,34 | C15.1 27.8,38 28.23,37.56 28.23,37 | 28.23,37 R6.2 | 28.23,37 28.23,40 | 28.23,40 28.23,41 28.23,41.16 27.71,41.69 R5.1 | 33.9,34.34 33.9,34 | 33.9,34 33.9,34.34 | 33.9,34.34 28.23,40
IO4  (via drill 0.3)
  Top 0.4: v65.8,31.2 65.8,29.9 v66.5,29.2
  Bottom 0.4: C19.1 77.95,38.05 77.5,38.5 R26.2 75.35,37.3 71.3,37.3 65.8,31.8 v65.8,31.2 | v66.5,29.2 64.4,27.1 64.4,25.9 64.04,25.54 U2.26
IO13  (via drill 0.3)
  Top 0.4: v44.9,28.9 40.7,28.9 37,32.6 v37,37.4
  Bottom 0.4: R25.2 34,41.85 C18.1 36.45,37.4 v37,37.4 | v44.9,28.9 45.9,29.9 48.9,29.9 49.55,29.24 U2.16
IO14  (via drill 0.35)
  Top 0.4: v55,26 55,31 56,32 56,33.2 55.4,33.8 55.4,38.4 56.6,39.6 59.9,39.6 61.1,40.8 61.1,42.7 62.6,44.2 v62.6,44.9
  Bottom 0.4: R24.2 63.15,55.35 63.5,55 64,55 | 64,55 64.7,55 65,54.7 C17.1 | U2.13 54.54,25.54 v55,26 | 64,55 62.6,53.6 v62.6,44.9
IO16  (via drill 0.35)
  Top 0.4: v31,56 31,54 36.3,48.7 36.3,31.8 40.9,27.2 45.9,27.2 50,23.1 v54.1,23.1
  Bottom 0.4: U2.27 60.17,24.27 59,23.1 v54.1,23.1 | Q7.S 31.63,56.63 v31,56
IO17  (via drill 0.35)
  Top 0.4: v85.5,37.6 85.5,38.4 84.95,38.95 | 84.95,38.95 84.7,39.2 82.7,41.2 69.2,41.2 63.25,35.25 63.25,30 | v60.3,21.7 60.4,21.8 60.4,26.9 63.25,29.75 | 84.95,38.95 | 63.25,30 63.25,29.75 | 63.25,30 63.25,29.75
  Bottom 0.4: Q6.S 85,36.28 85,37.1 v85.5,37.6 | U2.28 60.7,23 60.3,22.6 v60.3,21.7
IO18  (via drill 0.35)
  Top 0.4: v82.7,28.8 82.25,29.25 82,29.5 82,37 78.4,40.6 69.6,40.6 64.1,35.1 64.1,29.4 61.2,26.5 61.2,21.8 v61.2,20.8
  Bottom 0.4: Q5.S 83.08,28.41 v82.7,28.8 | v61.2,20.8 61.54,20.46 U2.30
IO19  (via drill 0.3, 0.35)
  Top 0.4: v81.4,22.9 81.4,36.6 78,40 70,40 65,35 v65,20.1
  Bottom 0.4: U2.31 64.61,19.19 65,19.58 v65,20.1 | Q4.S 81.76,20.34 81.4,20.7 v81.4,22.9
IO21  (via drill 0.35)
  Top 0.4: v60,16.7 58.2,18.5 58.2,23.8 59.8,25.4 59.8,27.3 62.6,30.1 62.6,35.7 68.9,42 78,42 78.8,42.8 v78.8,52
  Bottom 0.4: v60,16.7 62.95,16.7 U2.33 | U3.3 81.37,56.57 80.9,56.1 | R18.1 80.15,55 80.15,55.35 80.9,56.1 | 80.9,56.1 78.8,54 v78.8,52
IO22  (via drill 0.35)
  Top 0.4: v59.3,16.1 57.5,17.9 57.5,24.1 59,25.6 59,27.6 61.8,30.4 61.8,36 68.4,42.6 77.6,42.6 78,43 78,51.9 v77.9,52 | v79,55.4 81,55.4 v81.5,54.9
  Bottom 0.4: U2.36 62.94,12.9 61.3,12.9 59.3,14.9 v59.3,16.1 | v79,55.4 78.25,54.65 R19.1 76.1,53.8 v77.9,52 | U3.4 82.78,55.92 83.2,55.5 83.2,55.1 82.9,54.8 82.1,54.8 82,54.9 v81.5,54.9
IO23  (via drill 0.35)
  Top 0.4: v15,27 16,26 16,15 21.8,9.2 39.7,9.2 46.5,16 v47,16
  Bottom 0.4: Q3.S 15,27.58 v15,27 | U2.37 61.73,11.57 59.6,13.7 58.7,13.7 57,12 52.02,12 50.02,14 49,14 v47,16
IO25  (via drill 0.35)
  Top 0.4: v14,48 15.7,49.7 | 15.7,49.7 | 15.7,49.7 18.4,49.7 21,47.1 21,25 22,24 v39.9,24
  Bottom 0.4: Q1.S 13.5,48.5 v14,48 | v39.9,24 40.3,23.6 41,23.6 | 41.3,23.6 41,23.6 | 41,23.6 41.3,23.6 | 41.3,23.6 42.95,21.95 | 42.95,21.95 43.17,21.73 | 42.95,21.95 43.17,21.73 | 43.17,21.73 U2.10
IO26  (via drill 0.35)
  Top 0.4: v14,35 15,36 15,47.6 16.4,49 18,49 20,47 20,24 21,23 v43,23
  Bottom 0.4: Q2.S 14,35.95 v14,35 | U2.11 v43,23
IO27  (via drill 0.3)
  Top 0.4: v35.5,40.4 35.5,30.5 v41.6,24.4
  Bottom 0.4: C16.1 34,45.15 R23.2 35.7,43.15 35.7,40.6 v35.5,40.4 | v41.6,24.4 41.73,24.27 U2.12
IO32  (via drill 0.3)
  Top 0.4: v21.1,14.5 24.6,11 37,11 43,17 v43,19
  Bottom 0.4: C20.2 17,17.2 18.2,16 | 18.2,16 R27.2 | 18.2,16 | 18.2,16 17.1,16 16.8,15.7 16.8,15 17.3,14.5 v21.1,14.5 | v43,19 43.19,19.19 U2.8
IO33  (via drill 0.3)
  Top 0.4: v64.3,21.5 61.8,19 v60,19
  Bottom 0.4: C21.2 67.1,26.95 67.1,25.8 66.15,24.85 R28.2 66.15,23.35 v64.3,21.5 | v60,19 60,18 58,16 58,14.6 56.5,13.1 52,13.1 50.2,14.9 50.2,19.4 49.1,20.5 49,20.5 48.9,20.5 45.04,20.5 U2.9
IO35  (via drill 0.3, 0.35)
  Top 0.4: v77,43.5 68.2,43.5 60.8,36.1 60.8,30.6 58.1,27.9 58.1,25.9 56.5,24.3 56.5,22.8 55.2,21.5 50.5,21.5 50,21 50,19 48.8,17.8 v47.1,17.8
  Bottom 0.4: R21.2 80.15,45.85 82,44 R22.1 77.65,42.85 v77,43.5 | v47.1,17.8 46.98,17.92 U2.7
N$1  (via drill 0.3)
  Top 0.4: TPAD5.P$1 25,19 v21,19
  Bottom 0.4: v21,19 20.5,18.5 20.5,17.6 20.85,17.25 R27.1
N$2
  Bottom 0.4: J8.D- 85.35,5.55 82.95,7.95 C11.1 82.95,10.25 80.9,12.3 R10.2
N$3
  Bottom 0.4: R11.2 83,12.3 84.4,10.9 84.4,8.63 | 84.4,8.63 C9.1 | C9.1 84.53,7.77 86,6.3 J8.D+ | 84.4,8.63 C9.1
N$4  (via drill 0.35)
  Top 0.4: v74.6,22.3 75.5,22.3 76.6,21.2 v76.6,14.7
  Bottom 0.4: v74.6,22.3 73.82,21.52 U1.17 | v76.6,14.7 77.9,13.4 77.9,8.95 77.53,8.57 RX.C
N$5  (via drill 0.35)
  Top 0.4: v78.2,25.4 78.2,14.7 76.9,13.4 v76.9,13.1
  Bottom 0.4: U1.10 77.63,24.83 v78.2,25.4 | TX.C 76.92,13.09 v76.9,13.1
N$6
  Bottom 0.4: C8.2 20.41,24.95 SW1.P$2.1 SW1.P$2 28,26.82 28,29 25.33,31.67 R4.1
N$7
  Bottom 0.75: R1.1 75.38,8.53 RX.A
N$8
  Bottom 0.75: R2.1 75.18,10.76 TX.A
N$9
  Bottom 0.4: R7.1 75.22,29.07 T1.B
N$10  (via drill 0.3)
  Top 0.4: v75.9,26.3 74.8,25.2 v70.9,25.2
  Bottom 0.4: T2.B 70.58,32.42 | 70.58,32.42 70.5,32.35 | v70.9,25.2 70.5,25.6 70.5,32.35 | R8.1 77.67,27.07 76.9,26.3 v75.9,26.3 | 70.58,32.42 70.5,32.35
N$11  (via drill 0.35)
  Top 0.4: POWER.A 17.97,58.53 v18,58.5
  Bottom 0.4: v18,58.5 18.28,58.22 R9.1
N$12
  Bottom 0.4: 37,24.95 SW2.P$2.1 33.05,24.95 31.6,26.4 31.6,28.2 31.16,28.63 C10.2 | 37,24.95 SW2.P$2 | R6.1 30.44,34.77 32.2,33 32.2,26.7 33.05,25.85 36.1,25.85 37,24.95
N$13  (via drill 0.3)
  Top 0.4: TPAD6.P$1 70.1,18.9 70.1,23.7 69.8,24 v69.6,24
  Bottom 0.4: v69.6,24 R28.1
N$14
  Bottom 0.4: U1.12 77,18 78.7,16.3 80.7,16.3 80.9,16.1 R10.1
N$15
  Bottom 0.4: U1.11 77.63,18.37 79,17 82,17 83,16 R11.1
N$16
  Bottom 0.4: J1.1 10.6,48 11.5,48.9 Q1.D 11.5,52.5 12.15,53.15 R12.1
N$17
  Bottom 0.4: J2.1 11,36 11.5,36.5 Q2.D 11.5,38.7 15,42.2 R13.1
N$18  (via drill 0.35)
  Top 0.4: v12,31 11,32 | v17,48 16,47 16,33 15,32 11,32 | 11,32 4,32 3,31 v3,26
  Bottom 0.4: Q3.D 12.16,30.84 v12,31 | R14.1 17.15,48.15 v17,48 | J3.1 4,24 3,25 v3,26
N$19
  Bottom 0.4: 88,18 88,19.24 88,21.85 R15.1 | 88,18 88,17.24 | 88,17.24 | Q4.D 86.61,19.39 88,18 | J4.1 89.24,16 88,17.24
N$21
  Top 0.4: LED1.2-DOUT 46,49 49,49 52.05,45.95 LED2.4-DIN
N$33  (via drill 0.35)
  Top 0.4: v59.6,42.6 61.4,44.4 61.4,47.6 59.75,49.25 LED2.2-DOUT | LED3.4-DIN 38.55,37.85 37.4,39 37.4,41.8 38.1,42.5 v43.4,42.5
  Bottom 0.4: v43.4,42.5 59.5,42.5 v59.6,42.6
N$38  (via drill 0.35)
  Top 0.4: v51.3,37.9 52.1,37.9 LED4.4-DIN | v48,41 46,41 LED3.2-DOUT
  Bottom 0.4: v48,41 51.1,37.9 v51.3,37.9
N$39  (via drill 0.35)
  Top 0.4: LED4.2-DOUT 59.85,41.15 v60,41 | v38.8,32.6 40.42,30.98 LED5.4-DIN
  Bottom 0.4: v60,41 60.4,40.6 60.4,39.6 57.4,36.6 40.3,36.6 38.8,35.1 38.8,33.2 v38.8,32.6
N$40  (via drill 0.35)
  Top 0.4: v89,25 89.2,25 89.5,25.3 89.5,28.9 v90,29.4
  Bottom 0.4: Q5.D 88.4,25 v89,25 | J5.1 91.5,28.8 90.9,29.4 v90,29.4 89.45,29.4 R16.1
N$41  (via drill 0.35)
  Top 0.4: v89,37 89,42 90,43 v91,43
  Bottom 0.4: Q6.D 88.56,34.56 89,35 v89,37 88.15,37 R17.1 | v91,43 91.5,42.5 J6.1
N$42  (via drill 0.3, 0.35)
  Top 0.4: LED5.2-DOUT 47.28,34.28 v48,35 | LED6.4-DIN 51.12,30.98 50.7,31.4 v50.7,32
  Bottom 0.4: v48,35 48.5,35.5 50.2,35.5 50.7,35 v50.7,32
N$43  (via drill 0.35)
  Top 0.4: LED1.4-DIN 42.85,45.85 43.4,46.4 v43.4,46.9
  Bottom 0.4: v43.4,46.9 43.4,48.8 39.1,53.1 | 39.1,53.1 36.6,55.6 35.25,55.6 Q7.D | R20.1 39,53.2 39.1,53.1
N$46
  Bottom 0.4: R21.1 83,47 84,48 84,50 84.85,50.85 C14.2 86.15,50.85 89,48 J7.3
N$50  (via drill 0.3)
  Top 0.4: v30.86,45.14 TPAD1.P$1
  Bottom 0.4: R23.1 32.01,45.14 v30.86,45.14
N$51  (via drill 0.3)
  Top 0.4: TPAD2.P$1 68.2,51.8 68.2,54.7 68.1,54.7 v67.4,55.4
  Bottom 0.4: v67.4,55.4 66.8,56 R24.1
N$52  (via drill 0.3)
  Top 0.4: TPAD3.P$1 30,33 v30,41
  Bottom 0.4: v30,41 31,42 R25.1
N$53  (via drill 0.3)
  Top 0.4: TPAD4.P$1 71,38.1 v71.6,38.7
  Bottom 0.4: v71.6,38.7 74.65,38.7 R26.1
RTS
  Bottom 0.4: U1.2 72.55,26.07 73,26.52 74.22,26.52 75.7,28 R8.2 77.1,29.13 78.33,29.13 78.9,29.7 78.9,30.85 T1.E
RXD
  Bottom 0.4: U2.34 66.78,15.38 73.82,22.42 U1.4
TXD
  Bottom 0.4: U1.20 70.97,18.79 66.29,14.11 U2.35

### Text on the board
tNames: Kachi-sys for NITTC Procon Semi Room / Designed by Kapipara 2018/12/01 rev.2
bNames: 1 | Q1 | Q2 | Q6 | Q3 | Q5 | Q4